# Altium schematic sheet Sheet1.SchDoc
size A4; SheetNumber: 1; SheetTotal: 1
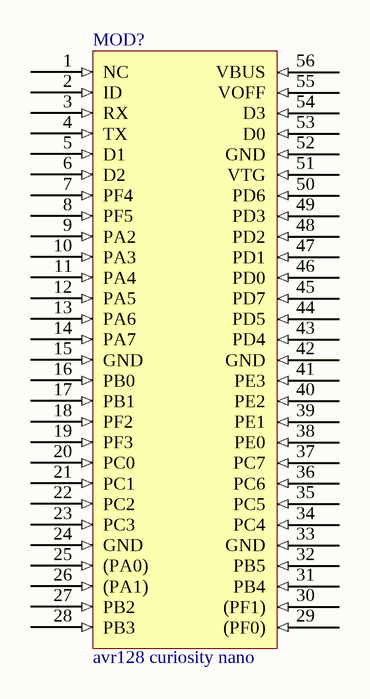
[diagram p0: Sheet1.SchDoc]

## Parts
MOD?  avr128 curiosity nano  [avr128 curiosity nano]

## Nets

Not connected (* = marked no-connect by the designer): MOD? 1(NC) 2(ID) 3(RX) 4(TX) 5(D1) 6(D2) 7(PF4) 8(PF5) 9(PA2) 10(PA3) 11(PA4) 12(PA5) 13(PA6) 14(PA7) 15(GND) 16(PB0) 17(PB1) 18(PF2) 19(PF3) 20(PC0) 21(PC1) 22(PC2) 23(PC3) 24(GND) 25((PA0)) 26((PA1)) 27(PB2) 28(PB3) 29((PF0)) 30((PF1)) 31(PB4) 32(PB5) 33(GND) 34(PC4) 35(PC5) 36(PC6) 37(PC7) 38(PE0) 39(PE1) 40(PE2) 41(PE3) 42(GND) 43(PD4) 44(PD5) 45(PD7) 46(PD0) 47(PD1) 48(PD2) 49(PD3) 50(PD6) 51(VTG) 52(GND) 53(D0) 54(D3) 55(VOFF) 56(VBUS)